# Altium schematic sheet OvercurrentDetection.SchDoc
size A4; Organization: UltraZohm; DocumentNumber: 7; SheetNumber: 7; SheetTotal: 11; Website: www.ultrazohm.com
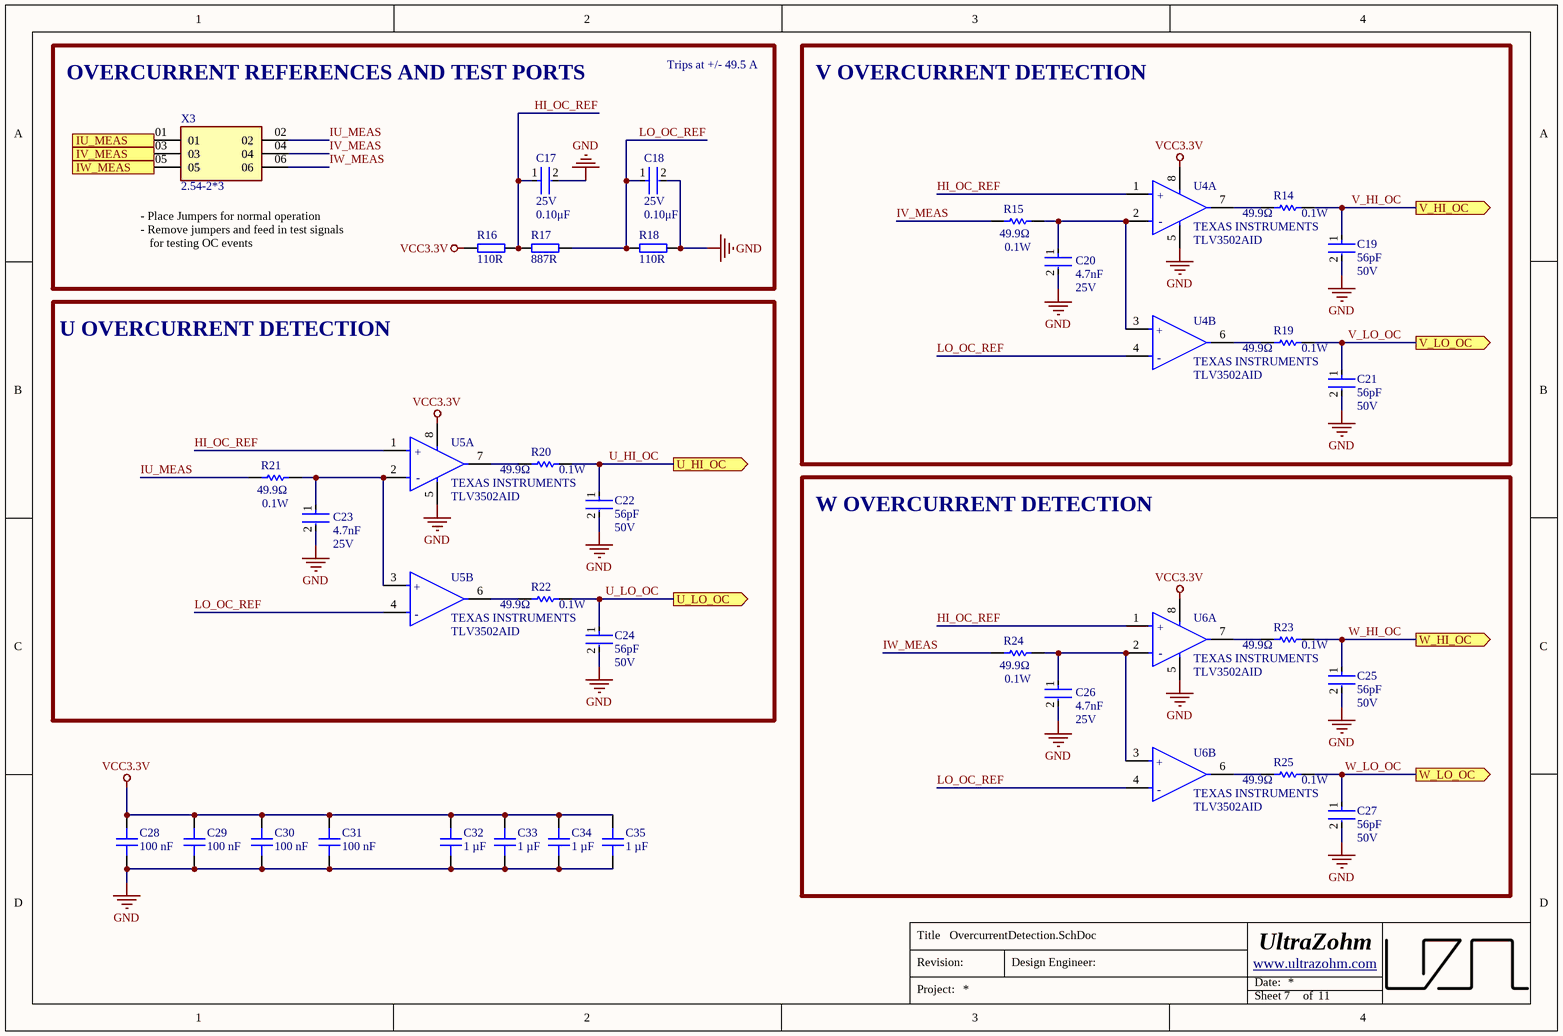
[diagram p0: OvercurrentDetection.SchDoc]

## Parts
C17  Voltage Rating: 25V  Capacitance: 0.10μF  [FP-C0603C-CF-IPC_B]  (hidden comment: C0603C104K3RACTU)
C18  Voltage Rating: 25V  Capacitance: 0.10μF  [FP-C0603C-CF-IPC_B]  (hidden comment: C0603C104K3RACTU)
C19  Capacitance: 56pF  Voltage Rating: 50V  [FP-C0603C-CF-IPC_B]  (hidden comment: CL10C560JB8NNNC)
C20  Voltage Rating: 25V  Capacitance: 4.7nF  [FP-C0603C-CF-IPC_B]  (hidden comment: C0603C472K3RAC7867)
C21  Capacitance: 56pF  Voltage Rating: 50V  [FP-C0603C-CF-IPC_B]  (hidden comment: CL10C560JB8NNNC)
C22  Capacitance: 56pF  Voltage Rating: 50V  [FP-C0603C-CF-IPC_B]  (hidden comment: CL10C560JB8NNNC)
C23  Voltage Rating: 25V  Capacitance: 4.7nF  [FP-C0603C-CF-IPC_B]  (hidden comment: C0603C472K3RAC7867)
C24  Capacitance: 56pF  Voltage Rating: 50V  [FP-C0603C-CF-IPC_B]  (hidden comment: CL10C560JB8NNNC)
C25  Capacitance: 56pF  Voltage Rating: 50V  [FP-C0603C-CF-IPC_B]  (hidden comment: CL10C560JB8NNNC)
C26  Voltage Rating: 25V  Capacitance: 4.7nF  [FP-C0603C-CF-IPC_B]  (hidden comment: C0603C472K3RAC7867)
C27  Capacitance: 56pF  Voltage Rating: 50V  [FP-C0603C-CF-IPC_B]  (hidden comment: CL10C560JB8NNNC)
C28  100 nF  [C_0603]
C29  100 nF  [C_0603]
C30  100 nF  [C_0603]
C31  100 nF  [C_0603]
C32  1 µF  [C_0603]
C33  1 µF  [C_0603]
C34  1 µF  [C_0603]
C35  1 µF  [C_0603]
R14  Resistance: 49.9Ω  Power Rating: 0.1W  [FP-MCR03-IPC_B]  (hidden comment: ERJ-3EKF49R9V)
R15  Resistance: 49.9Ω  Power Rating: 0.1W  [FP-MCR03-IPC_B]  (hidden comment: ERJ-3EKF49R9V)
R16  110R  [R_0603_TE]
R17  887R  [R_0603_TE]
R18  110R  [R_0603_TE]
R19  Resistance: 49.9Ω  Power Rating: 0.1W  [FP-MCR03-IPC_B]  (hidden comment: ERJ-3EKF49R9V)
R20  Resistance: 49.9Ω  Power Rating: 0.1W  [FP-MCR03-IPC_B]  (hidden comment: ERJ-3EKF49R9V)
R21  Resistance: 49.9Ω  Power Rating: 0.1W  [FP-MCR03-IPC_B]  (hidden comment: ERJ-3EKF49R9V)
R22  Resistance: 49.9Ω  Power Rating: 0.1W  [FP-MCR03-IPC_B]  (hidden comment: ERJ-3EKF49R9V)
R23  Resistance: 49.9Ω  Power Rating: 0.1W  [FP-MCR03-IPC_B]  (hidden comment: ERJ-3EKF49R9V)
R24  Resistance: 49.9Ω  Power Rating: 0.1W  [FP-MCR03-IPC_B]  (hidden comment: ERJ-3EKF49R9V)
R25  Resistance: 49.9Ω  Power Rating: 0.1W  [FP-MCR03-IPC_B]  (hidden comment: ERJ-3EKF49R9V)
U4  TLV3502AID  Manufacturer Print: TEXAS INSTRUMENTS  [FP-D0008A-IPC_B]  (parts A,B of 2)
U5  TLV3502AID  Manufacturer Print: TEXAS INSTRUMENTS  [FP-D0008A-IPC_B]  (parts A,B of 2)
U6  TLV3502AID  Manufacturer Print: TEXAS INSTRUMENTS  [FP-D0008A-IPC_B]  (parts A,B of 2)
X3  2.54-2*3  [SAMTEC_TSW-103-05-G-D]

## Blocks framed on the sheet
OVERCURRENT REFERENCES AND TEST PORTS: C17 C18 R16-R18 X3
V OVERCURRENT DETECTION: C19-C21 R14 R15 R19 U4
U OVERCURRENT DETECTION: C22-C24 R20-R22 U5
W OVERCURRENT DETECTION: C25-C27 R23-R25 U6

## Ports
IU_MEAS (in, see TopSheet[2A], Connector_Inverter[1B]), IV_MEAS (in, see TopSheet[2A], Connector_Inverter[1B]), IW_MEAS (in, see TopSheet[2A], Connector_Inverter[1B]), U_HI_OC (out, see TopSheet[3A], OvercurrentDetectionLogic[1A]), U_LO_OC (out, see TopSheet[3A], OvercurrentDetectionLogic[1A]), V_HI_OC (out, see TopSheet[3A], OvercurrentDetectionLogic[1B]), V_LO_OC (out, see TopSheet[3A], OvercurrentDetectionLogic[1B]), W_HI_OC (out, see TopSheet[3A], OvercurrentDetectionLogic[1B]), W_LO_OC (out, see TopSheet[3B], OvercurrentDetectionLogic[1B])

## Nets
GND: C17.2 C18.2 C19.2 C20.2 C21.2 C22.2 C23.2 C24.2 C25.2 C26.2 C27.2 C28.2 C29.2 C30.2 C31.2 C32.2 C33.2 C34.2 C35.2 R18.2 U4.5(V-) U5.5(V-) U6.5(V-)
VCC3.3V: C28.1 C29.1 C30.1 C31.1 C32.1 C33.1 C34.1 C35.1 R16.1 U4.8(V+) U5.8(V+) U6.8(V+)
HI_OC_REF: C17.1 R16.2 R17.1 U4.1(+IN_A) U5.1(+IN_A) U6.1(+IN_A)
IU_MEAS: R21.1 X3.02
IU_MEAS: X3.01 ; port IU_MEAS  [a separate net that carries the same name]
IV_MEAS: R15.1 X3.04
IV_MEAS: X3.03 ; port IV_MEAS  [a separate net that carries the same name]
IW_MEAS: R24.1 X3.06
IW_MEAS: X3.05 ; port IW_MEAS  [a separate net that carries the same name]
LO_OC_REF: C18.1 R17.2 R18.1 U4.4(-IN_B) U5.4(-IN_B) U6.4(-IN_B)
U_HI_OC: C22.1 R20.2 ; port U_HI_OC
U_LO_OC: C24.1 R22.2 ; port U_LO_OC
V_HI_OC: C19.1 R14.2 ; port V_HI_OC
V_LO_OC: C21.1 R19.2 ; port V_LO_OC
W_HI_OC: C25.1 R23.2 ; port W_HI_OC
W_LO_OC: C27.1 R25.2 ; port W_LO_OC
NetC20_1: C20.1 R15.2 U4.2(-IN_A) U4.3(+IN_B)
NetC23_1: C23.1 R21.2 U5.2(-IN_A) U5.3(+IN_B)
NetC26_1: C26.1 R24.2 U6.2(-IN_A) U6.3(+IN_B)
NetR14_1: R14.1 U4.7(OUT_A)
NetR19_1: R19.1 U4.6(OUT_B)
NetR20_1: R20.1 U5.7(OUT_A)
NetR22_1: R22.1 U5.6(OUT_B)
NetR23_1: R23.1 U6.7(OUT_A)
NetR25_1: R25.1 U6.6(OUT_B)

## Notes on the sheet
- Trips at +/- 49.5 A
- (near X3) - Place Jumpers for normal operation
  - Remove jumpers and feed in test signals
  for testing OC events
- Title
- Revision:
- Design Engineer:
- Date:
- Project:
- Sheet
- of
- (in symbol CMP-04896-000023-1, part A) +; -
- (in symbol CMP-04896-000023-1, part B) +; -

## Library data of the parts
C17 C18 = CMP-2006-03057-2: CAP CER 0.1UF 25V X7R 0603; Manufacturer: KEMET; Value: 0.10μF; Material: Ceramic; Tolerance: 0.1; Temperature Coefficient: 30ppm/°C; Automotive Grade: Grade 1; Lead Free: Yes; Device Class L3: Ceramic Capacitors; Manufacturer Part Number: C0603C104K3RACTU; Digikey Description: CAP CER 0.1UF 25V X7R 0603; Mouser Description: Multilayer Ceramic Capacitors MLCC - SMD/SMT 25volts 0.1uF X7R 10%; Package: 0603; Temperature Range Low: -55°C; Automotive: Yes; Device Class L2: Capacitors; Octopart: https://octopart.com/c0603c104k3ractu-kemet-127541; ComponentLink2Description: Datasheet; ComponentLink2URL: https://api.kemet.com/component-edge/download/datasheet/C0603C100J5GACAUTO.pdf; Temperature Range High: +125°C; RoHS: TRUE; Device Class L1: Passive Components; Category: Cap; Temperature: -55°C to +125°C; Height: 0.87mm; Temperature Characteristic: X7R
C19 C21 C22 C24 C25 C27 = CL10C560JB8NNNC: CAP CER 56PF 50V C0G/NP0 0603; Manufacturer: SAMSUNG; Material: Ceramic; Tolerance: 5%; Dielectric: C0G; Temperature Coefficient: 30ppm/°C; Supplier 1: Arrow Electronics; Manufacturer Part Number: CL10C560JB8NNNC; RoHS: Yes; Category: Ceramic Capacitors; Stock 1: 60182; Pricing 1: 1=0.05960, 10=0.01370, 25=0.01360, 100=0.01080, 250=0.01070, 500=0.00740, 1000=0.00590, 3000=0.00560, 6000=0.00530, 15000=0.00500, 30000=0.00470 (USD); Mount: Surface Mount; Case Code (Metric): 1608; Case Code (Imperial): 0603; Min Operating Temperature: -55°C; Max Operating Temperature: 125°C; Packaging: Tape and Reel; Package Quantity: 1; Voltage: 50V; Voltage Rating (DC): 50V; Series: CL; Construction: Flat; Termination: SMD/SMT; Length: 1.6mm; Width: 0.031inch; Height: 0.8mm; Thickness: 0.035inch; Depth: 0.8mm; Radiation Hardening: No; Lead Free: Lead Free; RoHS Compliant: Yes; ComponentLink1URL: https://datasheet.ciiva.com/25803/cl10c560jb8nnnc-25803592.pdf?src-supplier=Digi-Key; ComponentLink1Description: https://datasheet.ciiva.com/25803/cl10c560jb8nnnc-25803592.pdf?src-supplier=Digi-Key; ComponentLink2URL: https://datasheet.ciiva.com/26838/getdatasheetpartid-640760-26838546.pdf?src-supplier=Verical; ComponentLink2Description: https://datasheet.ciiva.com/26838/getdatasheetpartid-640760-26838546.pdf?src-supplier=Verical; ComponentLink3URL: https://datasheet.ciiva.com/29198/456837-da-01-en-vs-kondensator-0603-29198873.pdf?src-supplier=Conrad; ComponentLink3Description: https://datasheet.ciiva.com/29198/456837-da-01-en-vs-kondensator-0603-29198873.pdf?src-supplier=Conrad; ComponentLink4URL: https://datasheet.ciiva.com/48428/mlcc-catalogdownload2013-eng-48428598.pdf?src-supplier=Distrelec; ComponentLink4Description: https://datasheet.ciiva.com/48428/mlcc-catalogdownload2013-eng-48428598.pdf?src-supplier=Distrelec; ComponentLink5URL: https://datasheet.ciiva.com/16449/cl05b104kq5nnnc-16449527.pdf?src-supplier=Future+Electronics; ComponentLink5Description: https://datasheet.ciiva.com/16449/cl05b104kq5nnnc-16449527.pdf?src-supplier=Future+Electronics; Supplier Part Number 1: CL10C560JB8NNNC; Package: 0603; Value: 56pF
C20 C23 C26 = C0603C472K3RAC7867: CAP CER 4700PF 25V 10% X7R 0603; Manufacturer: KEMET; Manufacturer Part Number: C0603C472K3RACTU; Dielectric Material: Ceramic; Value: 4.7nF; Supplier 1: Newark; RoHS: Yes; Category: Ceramic Capacitors; Stock 1: 8000; Pricing 1: 1=0.04800, 4000=0.04800 (USD); Mount: Surface Mount; Package: 0603; Case Code (Metric): 1608; Case Code (Imperial): 0603; Min Operating Temperature: -55°C; Max Operating Temperature: 125°C; Tolerance: 10%; Dielectric: X7R; Packaging: Tape and Reel; Package Quantity: 1; Voltage Rating (DC): 25V; Termination: SMD/SMT; Dissipation Factor: 10%; Series: C; Construction: Flat; Length: 1.6mm; Width: 0.031inch; Height: 0.8mm; Thickness: 0.034inch; Lead Pitch: 0.7mm; Depth: 0.8mm; Radiation Hardening: No; Reach SVHC Compliant: Yes; RoHS Compliant: Yes; ComponentLink1URL: https://datasheet.ciiva.com/5414/kem-c1002-x7r-smd-357932-5414293.pdf?src-supplier=Mouser; ComponentLink1Description: https://datasheet.ciiva.com/5414/kem-c1002-x7r-smd-357932-5414293.pdf?src-supplier=Mouser; Supplier Part Number 1: 67AH9250
C28-C31 = C0603C104K5RAC3121: Capacitor 0603, 50 VDC, 100nF, X7R; Manufacturer: KEMET; Tolerance: 10 %; Voltage Rating: 50 VDC; Created from: DHufnagel; Manufacturer Part Number: C0603C104K5RAC3121; PartID: 99; Created On: 11/08/2022 14:33:29; ComponentLink1Description: Datasheet; ComponentLink1URL: https://www.mouser.de/datasheet/2/212/KEM_C1023_X7R_AUTO_SMD-1093309.pdf; Component Type: Capacitor 0603; Device Package: 0603; Last Updated: 19/08/2022 08:26:58; Mounting Type: SMD; Operating Temperature: -55 - 125°C; Series: X7R; Supplier 1: Mouser; Supplier Part Number 1: 80-C603C104K5RAC3121; Supplier 2: LCSC; Supplier Part Number 2: C14663; Type: Capacitor; Value: 100 nF; Live Cycle Status: 1; LCSC Part Number: C14663; Stock number: not stored
C32-C35 = C0603C105K3RAC7411: Capacitor 0603, 25 VDC, 1 µF, X7R; Manufacturer: KEMET; Tolerance: 10 %; Voltage Rating: 25 VDC; Created from: MGremer; Manufacturer Part Number: C0603C105K3RAC7411; PartID: 4; Created On: 20/12/2020 13:54:13; ComponentLink1Description: Datasheet; ComponentLink1URL: https://www.mouser.de/datasheet/2/212/KEM_C1002_X7R_SMD-1102033.pdf; Component Type: Capacitor 0603; Device Package: 0603; Last Updated: 20/12/2020 16:43:05; Mounting Type: SMD; Operating Temperature: -55 - 125°C; Series: SMD Comm X7R; Supplier 1: Mouser; Supplier Part Number 1: 80-C0603C105K3RLR; Type: Capacitor; Value: 1 µF; Live Cycle Status: 1; Stock number: Labor SMD Container; LCSC Part Number: C29936
R14 R15 R19-R25 = ERJ-3EKF49R9V: RES SMD 49.9 OHM 1% 1/10W 0603; Manufacturer: PANASONIC; Temperature Coefficient: 100ppm/°C; Voltage Rating: 75V; Max Power Dissipation: 100mW; Voltage Rating (DC): 50V; Working Voltage: 6V; Value: 49.9Ω; Supplier 1: Newark; Manufacturer Part Number: ERJ-3EKF49R9V; RoHS: Yes; Category: Chip SMD Resistors; Stock 1: 670000; Pricing 1: 1=0.00600, 5000=0.00600 (USD); Mount: Surface Mount; Package: 0603; Contact Plating: Tin; Case Code (Imperial): 0603; Case Code (Metric): 1608; Min Operating Temperature: -55°C; Max Operating Temperature: 155°C; Tolerance: 1%; Resistor Type: Thick Film; Packaging: Tape and Reel; Package Quantity: 5000; Number of Terminations: 2; Termination: SMD/SMT; Features: Automotive AEC-Q200; Series: ERJ; Resistance Tolerance: 1%; Construction: Rectangular; Technology: THICK FILM; Length: 1.6mm; Width: 0.8mm; Height: 0.022inch; Depth: 0.8mm; Radiation Hardening: No; Reach SVHC Compliant: Yes; Military Standard: Not; Lead Free: Lead Free; RoHS Compliant: Yes; ComponentLink1URL: https://datasheet.ciiva.com/46388/1678782-46388908.pdf?src-supplier=Element14; ComponentLink1Description: https://datasheet.ciiva.com/46388/1678782-46388908.pdf?src-supplier=Element14; ComponentLink2URL: https://datasheet.ciiva.com/28694/1678782-28694219.pdf?src-supplier=Element14; ComponentLink2Description: https://datasheet.ciiva.com/28694/1678782-28694219.pdf?src-supplier=Element14; ComponentLink3URL: https://datasheet.ciiva.com/16772/70260748-16772570.pdf?src-supplier=Allied+Electronics; ComponentLink3Description: https://datasheet.ciiva.com/16772/70260748-16772570.pdf?src-supplier=Allied+Electronics; ComponentLink4URL: https://datasheet.ciiva.com/16766/70260748-16766262.pdf?src-supplier=Allied+Electronics; ComponentLink4Description: https://datasheet.ciiva.com/16766/70260748-16766262.pdf?src-supplier=Allied+Electronics; ComponentLink5URL: https://datasheet.ciiva.com/9117/aoa0000ce2-9117128.pdf?src-supplier=Avnet; ComponentLink5Description: https://datasheet.ciiva.com/9117/aoa0000ce2-9117128.pdf?src-supplier=Avnet; ComponentLink6URL: https://datasheet.ciiva.com/48531/aoa0000ce2-48531019.pdf?src-supplier=Avnet; ComponentLink6Description: https://datasheet.ciiva.com/48531/aoa0000ce2-48531019.pdf?src-supplier=Avnet; ComponentLink7URL: https://datasheet.ciiva.com/30095/aoa0000ce2-30095355.pdf?src-supplier=Onlinecomponents.com; ComponentLink7Description: https://datasheet.ciiva.com/30095/aoa0000ce2-30095355.pdf?src-supplier=Onlinecomponents.com; Supplier Part Number 1: 12AC1058
R16 R18 = RT0603BRD07110RL: -55℃~+155℃ 100mW 110Ω 75V Thin Film Resistor ±0.1% ±25ppm/℃ 0603 Chip Resistor; Manufacturer: YAGEO; Created from: MHoerner; Manufacturer Part Number: RT0603BRD07110RL; PartID: 395; Created On: 11.06.2026 09:50:14; ComponentLink1Description: Datasheet; ComponentLink1URL: https://www.lcsc.com/datasheet/C705717.pdf?spm=wm.sxq.inf.ggs___wm.fly.bg.0.xh&lcsc_vid=FVULV11UQQVZVQFfRlANUAdQRVAPUAdeQlVcVlZXQFcxVlNeRlBYUVNeRVBaUDsOAxUeFF5JWBYZEEoKFBINSQcJGk4%3D; Component Type: SMD resistor; Device Package: 0603; Last Updated: 11.06.2026 09:50:14; Mounting Type: SMD; Supplier 1: LCSC; Supplier Part Number 1: C705717; Supplier 2: LCSC; Supplier Part Number 2: C705717; Type: Resistor; Tolerance: 0.1%; Value: 110R; Live Cycle Status: 1; LCSC Part Number: C705717
R17 = PTFR0603B887RN9: -55℃~+155℃ 100mW 887Ω 100V Thin Film Resistor ±0.1% ±10ppm/℃ 0603 Chip Resistor; Manufacturer: RESI; Created from: MHoerner; Manufacturer Part Number: PTFR0603B887RN9; PartID: 396; Created On: 11.06.2026 09:50:14; ComponentLink1Description: Datasheet; ComponentLink1URL: https://www.lcsc.com/datasheet/C47115921.pdf?spm=wm.sxq.inf.ggs___wm.fly.bg.0.xh&lcsc_vid=EQNYVVAFQVNdUwFRFgUPXlRURAANUFNWFgdZBgZURFgxVlNeRlBYUFFTRFRfVDsOAxUeFF5JWBYZEEoKFBINSQcJGk4eFQsCAgIaSgADAwAHC0slQFFbUFVRWQkaCgg%3D; Component Type: SMD resistor; Device Package: 0603; Last Updated: 11.06.2026 09:50:14; Mounting Type: SMD; Supplier 1: LCSC; Supplier Part Number 1: C47115921; Supplier 2: LCSC; Supplier Part Number 2: C47115921; Type: Resistor; Tolerance: 0.1%; Value: 887R; Live Cycle Status: 1; LCSC Part Number: C47115921
U4-U6 = CMP-04896-000023-1: IC COMPARATOR R-R HI-SPD 8-SOIC; Nominal Supply Current: 3.2mA; Standoff Height: 0.11mm; Max Supply Voltage: 5.5V; Min Supply Voltage: 2.2V; Input Bias Current: 0.000002uA; Number Of Channels: 2; Max Junction Temp: +150°C; Input Offset Voltage: 1mV; Automotive: No; Device Class L1: Integrated Circuits (ICs); Lead Free: Yes; Octopart: https://octopart.com/tlv3502aid-texas+instruments-428400; Temperature Range Low: -40°C; ComponentLink2Description: Datasheet; ComponentLink2URL: http://www.ti.com/lit/ds/symlink/tlv3502.pdf; Ambient Temperature Range Low: -40°C; Height: 1.75mm; Manufacturer: TEXAS INSTRUMENTS; Digikey Description: IC COMPARATOR R-R HI-SPD 8-SOIC; Ambient Temperature Range High: +125°C; RoHS: TRUE; Device Class L3: Comparators; Device Class L2: Linear ICs; Temperature: -40°C to +125°C; Manufacturer Part Number: TLV3502AID; Temperature Range High: +125°C; Package: 8-SOIC; Category: IC; Mouser Description: TLV3502AID Texas Instruments, Dual Comparator, Push-Pull O/P, 3 V, 5 V 8-Pin SOIC; Value: N/A
X3 = 2.54-2*3: Pin Header 3x2; Manufacturer: ZHOURI; MF: Samtec; Created from: KIlhan; Number of positions: 3; Availability: Unavailable; Value: *; Price: None; MP: TSW-103-05-G-D; Package: None; Manufacturer Part Number: 2.54-2*3; PartID: 14; Created On: 05.07.2023 16:24:09; ComponentLink1Description: Datasheet; ComponentLink1URL: https://datasheet.lcsc.com/lcsc/2207291800_ZHOURI-2-54-1-3_C5116482.pdf; Component Type: Pin Header; Device Package: THT; Last Updated: 11.02.2025 12:55:43; Mounting Type: THT; Operating Temperature: -55 -125 °C; Series: 2.54-1*3; Supplier 1: LCSC; Supplier Part Number 1: ZHOURI 2.54-1*3; Type: Pin Header; Live Cycle Status: 1; LCSC Part Number: C5116479; Stock number: not stored; Number of rows: 2